# Altium schematic sheet Liq_Controller.SchDoc
size 279 x 215 mm; SheetNumber: 1; SheetTotal: 3
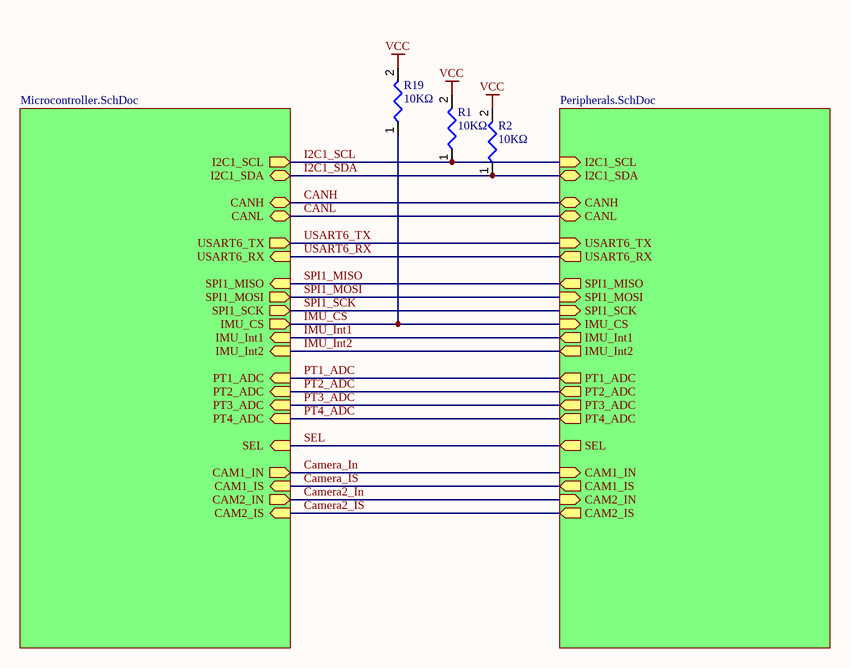
[diagram p0: Liq_Controller.SchDoc]

## Parts
R1  10KΩ  [RES_0603]
R2  10KΩ  [RES_0603]
R19  10KΩ  [RES_0603]

## Sub-sheets
Designator = Microcontroller.SchDoc: I2C1_SCL (out), I2C1_SDA (bidir), CANH (bidir), CANL (bidir), USART6_TX (out), USART6_RX (in), SPI1_MISO (in), SPI1_MOSI (out), SPI1_SCK (out), IMU_CS (out), IMU_Int1 (in), IMU_Int2 (in), PT1_ADC (in), PT2_ADC (in), PT4_ADC (in), PT3_ADC (in), SEL (in), CAM1_IN (out), CAM2_IN (out), CAM1_IS (in), CAM2_IS (in)
Designator = Peripherals.SchDoc: I2C1_SCL (in), I2C1_SDA (bidir), CANH (bidir), CANL (bidir), USART6_RX (out), USART6_TX (in), SPI1_MISO (out), SPI1_MOSI (in), SPI1_SCK (in), IMU_CS (in), IMU_Int1 (out), IMU_Int2 (out), PT1_ADC (out), PT2_ADC (out), PT4_ADC (out), PT3_ADC (out), SEL (out), CAM1_IN (in), CAM2_IN (in), CAM1_IS (out), CAM2_IS (out)

## Nets
VCC: R1.2 R2.2 R19.2
Camera2_In: sheet Designator/CAM2_IN, sheet Designator/CAM2_IN
Camera2_IS: sheet Designator/CAM2_IS, sheet Designator/CAM2_IS
Camera_In: sheet Designator/CAM1_IN, sheet Designator/CAM1_IN
Camera_IS: sheet Designator/CAM1_IS, sheet Designator/CAM1_IS
CANH: sheet Designator/CANH, sheet Designator/CANH
CANL: sheet Designator/CANL, sheet Designator/CANL
I2C1_SCL: R1.1 ; sheet Designator/I2C1_SCL, sheet Designator/I2C1_SCL
I2C1_SDA: R2.1 ; sheet Designator/I2C1_SDA, sheet Designator/I2C1_SDA
IMU_CS: R19.1 ; sheet Designator/IMU_CS, sheet Designator/IMU_CS
IMU_Int1: sheet Designator/IMU_Int1, sheet Designator/IMU_Int1
IMU_Int2: sheet Designator/IMU_Int2, sheet Designator/IMU_Int2
PT1_ADC: sheet Designator/PT1_ADC, sheet Designator/PT1_ADC
PT2_ADC: sheet Designator/PT2_ADC, sheet Designator/PT2_ADC
PT3_ADC: sheet Designator/PT3_ADC, sheet Designator/PT3_ADC
PT4_ADC: sheet Designator/PT4_ADC, sheet Designator/PT4_ADC
SEL: sheet Designator/SEL, sheet Designator/SEL
SPI1_MISO: sheet Designator/SPI1_MISO, sheet Designator/SPI1_MISO
SPI1_MOSI: sheet Designator/SPI1_MOSI, sheet Designator/SPI1_MOSI
SPI1_SCK: sheet Designator/SPI1_SCK, sheet Designator/SPI1_SCK
USART6_RX: sheet Designator/USART6_RX, sheet Designator/USART6_RX
USART6_TX: sheet Designator/USART6_TX, sheet Designator/USART6_TX

## Notes on the sheet
- Title
- Author
- Date
- Texas A&M Sounding Rocketry Team
- Revision

## Library data of the parts
R1 R2 R19 = 10 KOhm Resistor: Thick Film Resistors - SMD General Purpose Chip Resistor 0603, 10kOhms, 1%, 1/10W; Manufacturer 1: YAGEO; Manufacturer Part Number 1: RC0603FR-0710KL; MPN: 603-RC0603FR-0710KL; Tolerance: 0.01; Power: 0.1W; Value: 10KΩ; Package: 0603; Library Ref: Resistor_BASE; Design Item ID: 10 KOhm Resistor; Supplier 1: Mouser